# EAGLE design bpsdschematic2 (EAGLE 6.5.0)
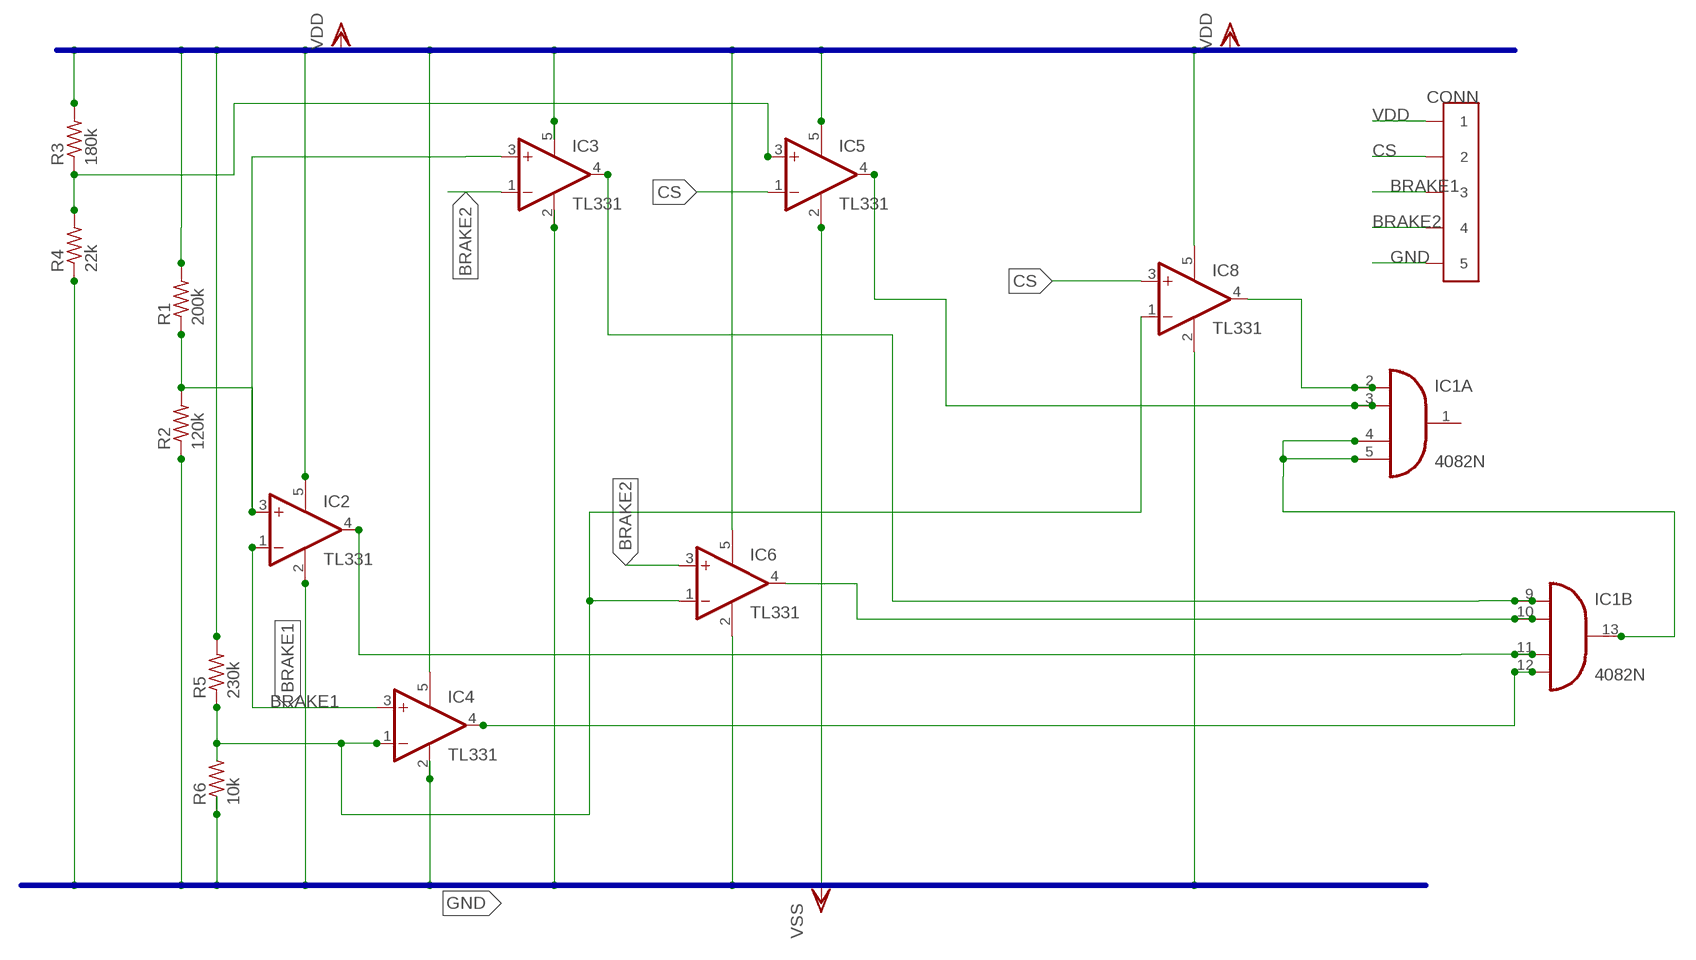
[diagram p0: schematic, sheet 1]

## Parts
CONN  CONN_5  [CONNECTOR_5]
IC1  4082N  [DIL14]
IC2  TL331  [DBV-R-PDSO-G5]
IC3  TL331  [DBV-R-PDSO-G5]
IC4  TL331  [DBV-R-PDSO-G5]
IC5  TL331  [DBV-R-PDSO-G5]
IC6  TL331  [DBV-R-PDSO-G5]
IC8  TL331  [DBV-R-PDSO-G5]
R1  200k  R-US_0207/15  [0207/15]
R2  120k  R-US_0207/15  [0207/15]
R3  180k  R-US_0207/15  [0207/15]
R4  22k  R-US_0207/15  [0207/15]
R5  230k  R-US_0207/15  [0207/15]
R6  10k  R-US_0207/15  [0207/15]

## Nets
BRAKE1: CONN.5 CONN.6 IC2.1(-IN) IC4.3(+IN)
BRAKE2: CONN.7 CONN.8 IC3.1(-IN) IC6.3(+IN)
CS: CONN.3 CONN.4 IC5.1(-IN) IC8.3(+IN)
GND: CONN.9 CONN.10 IC2.2(GND) IC3.2(GND) IC4.2(GND) IC5.2(GND) IC6.2(GND) IC8.2(GND) R2.1 R4.1 R6.1 ; supply symbol labelled VSS
N$3: IC1.12(B:I3) IC4.4(OUT)
N$4: IC1.11(B:I2) IC2.4(OUT)
N$5: IC1.10(B:I1) IC6.4(OUT)
N$6: IC1.9(B:I0) IC3.4(OUT)
N$7: IC1.2(A:I0) IC8.4(OUT)
N$9: IC1.4(A:I2) IC1.5(A:I3) IC1.13(B:O)
N$10: IC2.3(+IN) IC3.3(+IN) R1.1 R2.2
N$11: IC4.1(-IN) IC6.1(-IN) IC8.1(-IN) R5.1 R6.2
N$15: IC5.3(+IN) R3.1 R4.2
N$17: IC1.3(A:I1) IC5.4(OUT)
VDD: CONN.1 CONN.2 IC2.5(V+) IC3.5(V+) IC4.5(V+) IC5.5(V+) IC6.5(V+) IC8.5(V+) R1.2 R3.2 R5.2
Unconnected: IC1.1(A:O)

## Buses
GND
VDD

## Power pins joined to a net without a drawn wire
GND: IC1.7(P:VSS)
VDD: IC1.14(P:VDD)

## Library data of the parts
CONN = formula electric:CONN_5
IC1 = 40xx:4082: Dual 4-input AND
IC2-IC6 IC8 = linear:TL331: SINGLE DIFFERENTIAL COMPARATOR Source: Data sheet <http://www.ti.com/lit/ds/symlink/tl331-q1.pdf>
R1-R6 = rcl:R-US_: RESISTOR, American symbol

## Net classes
0 default: width 0.305 mm, drill 0.508 mm, clearance 0.254 mm

## Board
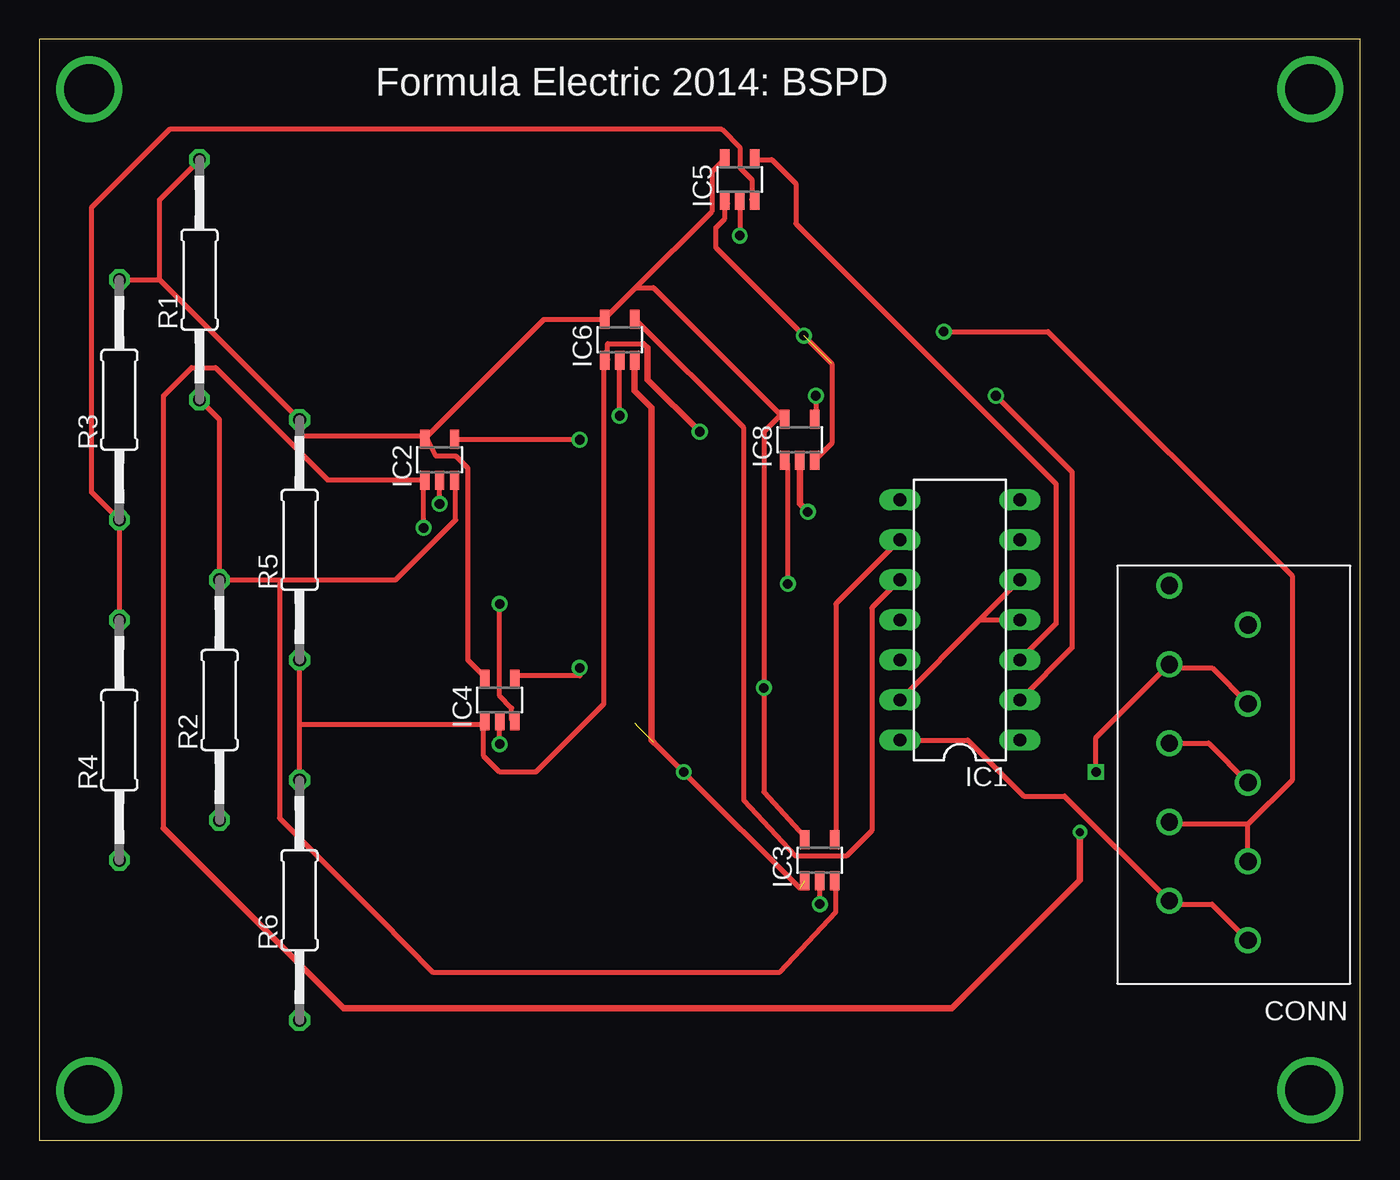
[diagram p1: board, top side]
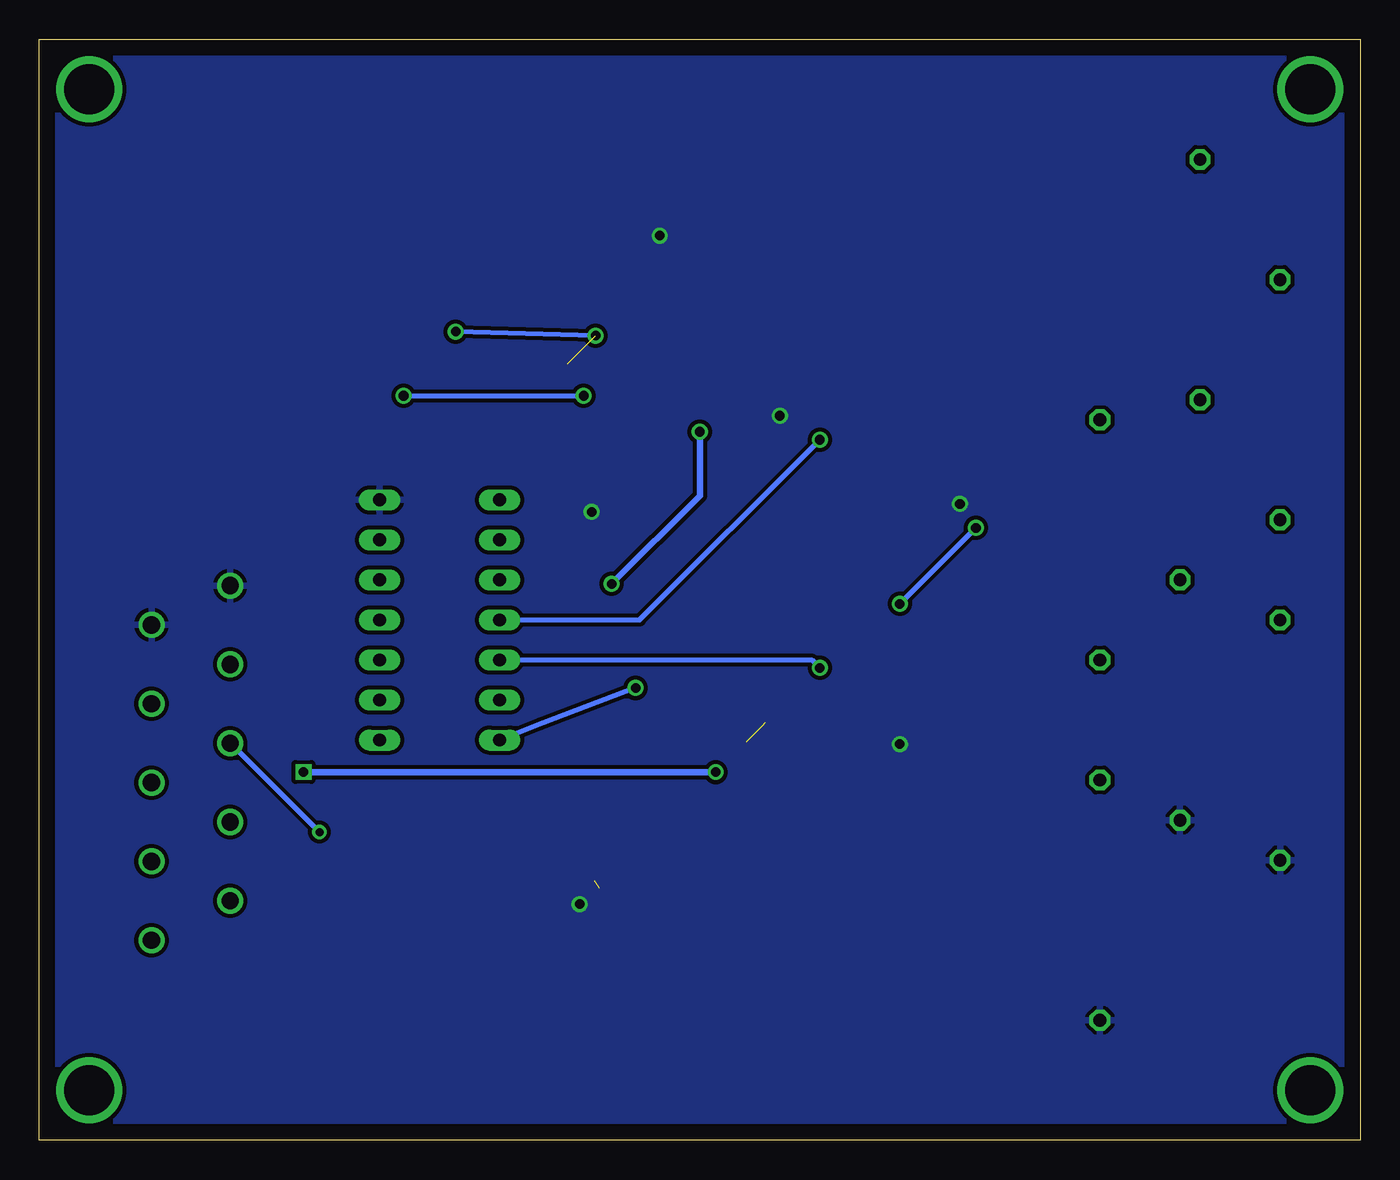
[diagram p2: board, bottom side, seen from below]

Size 83.82 x 69.85 mm. Coordinates in mm from the lower left corner, seen from the top.
Outline: 0,0 83.82,0 83.82,69.85 0,69.85 0,0
Copper layers (1*16): Top 0.035mm / dielectric 1.5mm / Bottom 0.035mm
Design rules "default *": minimum track width 10mil, minimum drill 20mil, track to track 8mil, track to pad 8mil, pad to pad 8mil, via to via 8mil, smd to smd 8mil, copper to edge 40mil, drill to drill 8mil, minimum pad ring 10mil, minimum via ring 8mil, stop-mask expansion 4mil, vias tented up to drill 0mil, thermal gap 10mil

### Footprints (pad centres in the part's own frame; a part is rotated, then mirrored left to right if it is on the bottom)
CONNECTOR_5 = drill 1.1: 1 0,0; 2 2.5,5; 3 5,0; 4 7.5,5; 5 10,0; 6 12.5,5; 7 15,0; 8 17.5,5; 9 20,0; 10 22.5,5
DIL14 = drill 0.813 long: 1 -7.62,-3.81; 2 -5.08,-3.81; 3 -2.54,-3.81; 4 0,-3.81; 5 2.54,-3.81; 6 5.08,-3.81; 7 7.62,-3.81; 8 7.62,3.81; 9 5.08,3.81; 10 2.54,3.81; 11 0,3.81; 12 -2.54,3.81; 13 -5.08,3.81; 14 -7.62,3.81
DBV-R-PDSO-G5 = smd 0.6 x 1.2: 1 -0.95,-1.306; 2 0,-1.306; 3 0.95,-1.306; 4 0.95,1.306; 5 -0.95,1.306
0207/15 = drill 0.813 octagon: 1 -7.62,0; 2 7.62,0

### Placement (x,y rotation side)
CONN  76.71,12.7 90 top
IC1  58.42,33.02 90 top
IC2  25.4,43.18 0 top
IC3  49.53,17.78 0 top
IC4  29.21,27.94 0 top
IC5  44.45,60.96 0 top
IC6  36.83,50.8 0 top
IC8  48.26,44.45 0 top
R1  10.16,54.61 90 top
R2  11.43,27.94 90 top
R3  5.08,46.99 90 top
R4  5.08,25.4 90 top
R5  16.51,38.1 90 top
R6  16.51,15.24 90 top

### Tracks (layer width: path | path; a pad name or v marks a point on that pad's centre or on a via)
BRAKE1  (via drill 0.51, 0.61)
  Top 0.305: v24.38,38.86 24.38,41.66 IC2.1 24.38,41.91 | v29.21,34.04 29.21,28.19 29.97,27.43 29.97,26.67 IC4.3 | 7.87,19.81 7.87,47.24 9.65,49.02 11.18,49.02 18.29,41.91 24.41,41.91 | CONN.6 74.21,25.2 CONN.5
  Top 0.406: v66.04,19.56 66.04,16.51 57.91,8.38 19.3,8.38 7.87,19.81 | 24.41,41.91 IC2.1
  Bottom 0.305: v29.21,34.04 v24.38,38.86 | v66.04,19.56 71.63,25.15 CONN.6
BRAKE2  (via drill 0.6)  (3 unrouted)
  Top 0.305: 38.99,25.27 v40.89,23.37 48.26,16 | v67.06,23.37 67.06,25.55 CONN.8 71.63,29.97 74.44,29.97 CONN.7
  Top 0.406: IC6.3 37.78,47.56 38.86,46.48 38.86,25.4 38.99,25.27
  Bottom 0.406: v40.89,23.37 v67.06,23.37
CS  (via drill 0.6, 0.61)  (1 unrouted)
  Top 0.305: 43.69,59.44 IC5.1 43.5,58.49 42.93,57.91 42.93,56.64 50.29,49.28 50.29,44.23 IC8.3 49.28,43.18 | 76.71,20.07 71.88,20.07 CONN.4 | CONN.3 76.71,20.07 | v57.4,51.31 64.01,51.31 79.5,35.81 79.5,22.86 76.71,20.07
  Bottom 0.305: v48.51,51.05 v57.4,51.31
GND  (via drill 0.6, 0.61)
  Top 0.305: v25.4,40.39 IC2.2 | v29.21,25.15 IC4.2 | v36.83,45.97 IC6.2 | v49.53,14.99 IC3.2 | IC5.2 v44.45,57.4
  Top 0.406: IC8.2 48.26,40.39 v48.77,39.88
  pour Bottom: -1.27,71.12 -0.76,-1.27 87.38,-1.27 87.12,70.87
N$1  (via drill 3.17)
  other vias: 3.17,3.17
N$2  (via drill 3.17)
  other vias: 80.64,3.17
N$3  (via drill 0.61)
  Top 0.305: v34.29,29.97 34.29,29.46 30.23,29.46 IC4.4
  Bottom 0.305: v34.29,29.97 34.8,30.48 IC1.12
N$4  (via drill 0.61)
  Top 0.305: v34.29,44.45 26.42,44.45 IC2.4
  Bottom 0.305: v34.29,44.45 45.72,33.02 IC1.11
N$5
  Top 0.305: IC1.10 52.83,33.78 52.83,19.66 51.21,18.03 48.01,18.03 44.7,21.59 44.7,45.21 37.85,52.07 IC6.4
N$6
  Top 0.305: IC1.9 50.55,34.04 50.55,19.3 IC3.4
N$7  (via drill 0.61)
  Top 0.305: v49.28,47.24 49.28,45.97 IC8.4 | v60.71,47.24 65.53,42.42 65.53,31.24 IC1.2
  Bottom 0.305: v60.71,47.24 v49.28,47.24
N$8  (via drill 3.17)
  other vias: 80.64,66.67
N$9
  Top 0.305: IC1.5 59.69,33.02 | 59.69,33.02 IC1.13 | 59.69,33.02 IC1.4
N$10
  Top 0.305: 15.24,35.56 R2.2 11.43,45.72 R1.1 | 15.24,35.56 22.61,35.56 26.42,39.37 26.42,41.66 IC2.3 | 15.24,35.56 15.24,20.45 21.58,14.1 24.95,10.67 46.99,10.67 50.55,14.48 50.55,16.26 IC3.3
N$11  (via drill 0.61)
  Top 0.305: 16.51,26.42 28.19,26.42 IC4.1 28.19,26.57 28.19,24.38 29.21,23.37 31.5,23.37 35.81,27.69 35.81,49.28 IC6.1 36.07,49.53 36.07,50.55 38.35,50.55 38.61,50.29 | R6.2 16.51,26.42 | v47.5,35.31 47.5,42.93 IC8.1 | 16.51,26.42 R5.1
  Top 0.406: 38.61,50.29 38.61,48.26 v41.91,44.96
  Bottom 0.406: v41.91,44.96 41.91,40.89 v47.5,35.31
N$12  (via drill 3.17)
  other vias: 3.17,66.67
N$15
  Top 0.305: IC5.3 45.21,59.69 45.21,60.96 44.45,61.72 44.45,62.99 43.31,64.14 8.26,64.14 3.3,59.18 3.3,41.15 R3.1 R4.2
N$17
  Top 0.305: IC5.4 45.47,62.23 46.48,62.23 48.01,60.71 48.01,58.17 64.52,41.66 64.52,32.77 IC1.3
VDD  (via drill 0.61)
  Top 0.305: IC2.5 24.38,44.7 16.51,44.7 R5.2 7.62,54.61 | IC4.5 28.19,29.46 27.18,30.48 27.18,42.67 26.42,43.43 25.15,43.43 24.64,44.45 IC2.5 | IC5.5 43.43,62.23 42.67,61.47 42.67,58.93 37.85,54.1 | IC3.5 48.51,19.3 45.97,22.1 v45.97,28.7 45.97,44.96 46.99,45.97 47.24,45.97 IC8.5 38.96,54.1 37.85,54.1 | IC2.5 24.64,44.7 32,52.07 35.81,52.07 IC6.5 | 76.2,12.7 CONN.1 74.42,14.99 71.88,14.99 CONN.2 | 71.63,15.24 CONN.2 | R3.2 7.62,54.61 | 7.62,54.61 7.62,59.69 R1.2 | 35.88,52.14 37.85,54.1 | IC1.14 58.93,25.4 62.48,21.84 65.06,21.84 CONN.2
  Top 0.406: IC6.5 35.88,52.14
  Bottom 0.305: IC1.14 52.07,26.42 v45.97,28.7

### Text on the board
tNames: Formula Electric 2014: BSPD